# Altium schematic sheet PocketPilot.SchDoc
size A4; SheetNumber: 2; SheetTotal: 3
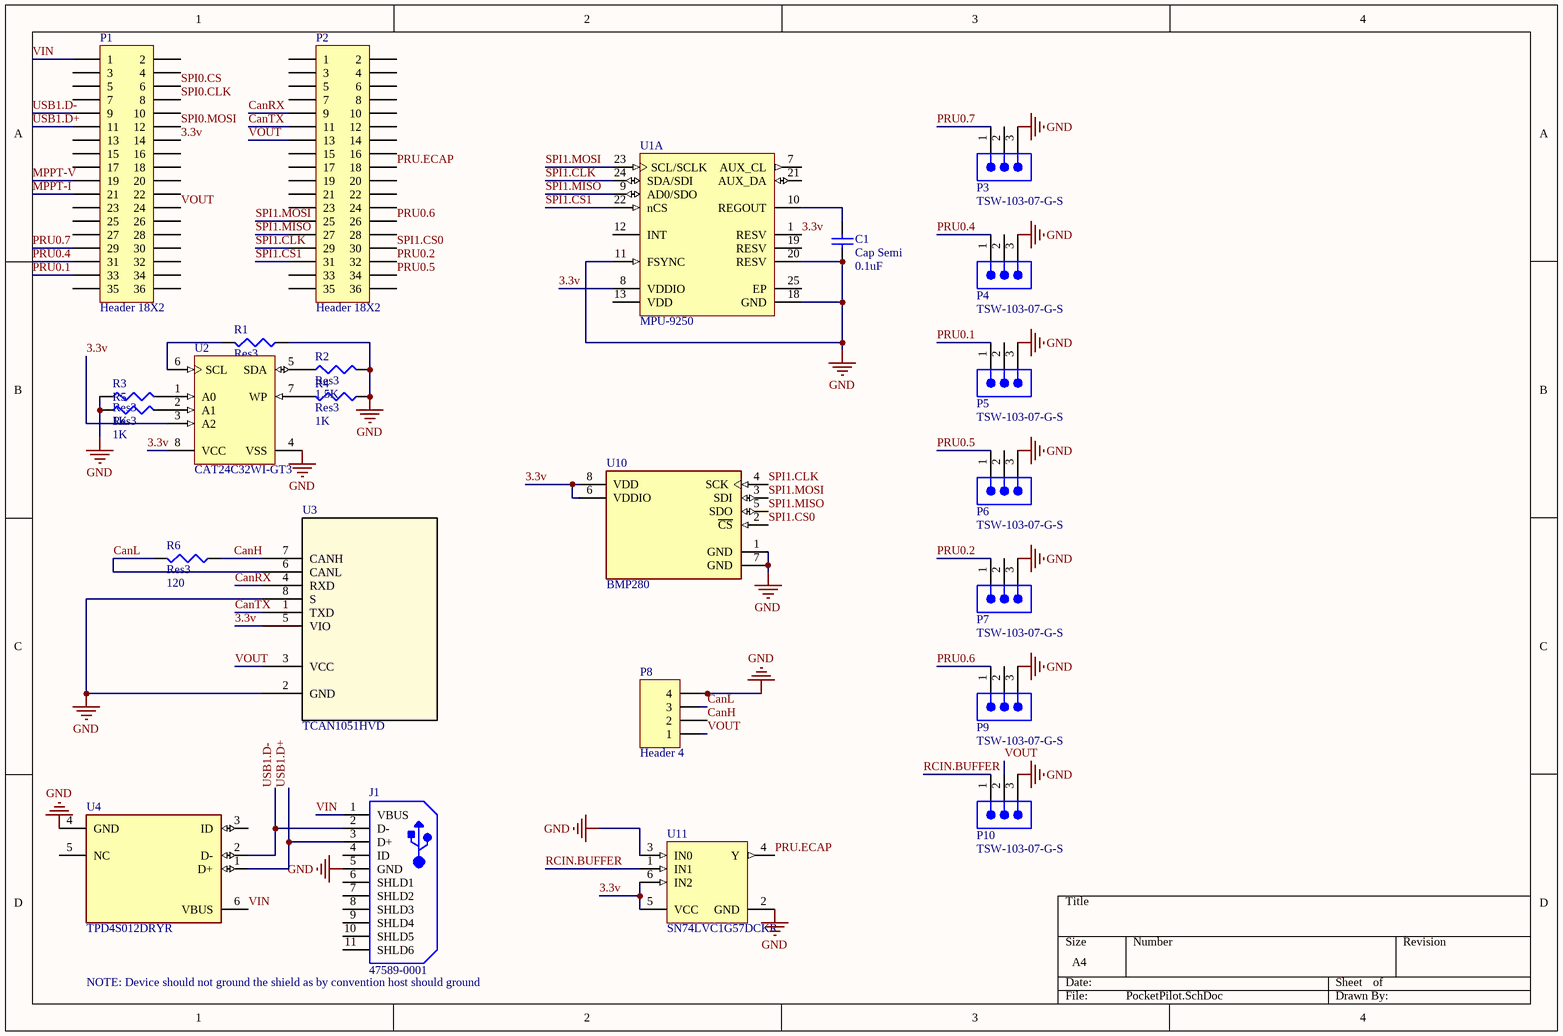
[diagram p0: PocketPilot.SchDoc]

## Parts
C1  Cap Semi  value 0.1uF  [C1206]
J1  47589-0001  [MOLX-47589-0001_V]
P1  Header 18X2  [HDR2X18]
P2  Header 18X2  [HDR2X18]
P3  TSW-103-07-G-S  [SMTC-TSW-103-07-X-S]
P4  TSW-103-07-G-S  [SMTC-TSW-103-07-X-S]
P5  TSW-103-07-G-S  [SMTC-TSW-103-07-X-S]
P6  TSW-103-07-G-S  [SMTC-TSW-103-07-X-S]
P7  TSW-103-07-G-S  [SMTC-TSW-103-07-X-S]
P8  Header 4  [HDR1X4]
P9  TSW-103-07-G-S  [SMTC-TSW-103-07-X-S]
P10  TSW-103-07-G-S  [SMTC-TSW-103-07-X-S]
R1  Res3  value 1.5K  [J1-0603]
R2  Res3  value 1.5K  [J1-0603]
R3  Res3  value 1K  [J1-0603]
R4  Res3  value 1K  [J1-0603]
R5  Res3  value 1K  [J1-0603]
R6  Res3  value 120  [J1-0603]
U1  MPU-9250  [INSE-QFN-24-1700X1540TP_M]  (part A of 2)
U2  CAT24C32WI-GT3  [ONSC-SOIC-8-751BD-01_M]
U3  TCAN1051HVD  [D8_TEX]
U4  TPD4S012DRYR  [FP-DRY0006A-MFG]
U10  BMP280  [FP-BMP280-MFG]
U11  SN74LVC1G57DCKR  [DCK0006A_N]

## Nets
GND: C1.1 J1.5(GND) P3.3 P4.3 P5.3 P6.3 P7.3 P8.4 P9.3 P10.3 R1.1 R2.2 R3.1 R4.1 R5.1 U1.11(FSYNC) U1.18(GND) U1.20(RESV) U2.4(VSS) U3.2(GND) U3.8(S) U4.4(GND) U10.1(GND) U10.7(GND) U11.2(GND) U11.3(IN0)
3.3v: P1.14 U1.1(RESV) U1.8(VDDIO) U2.3(A2) U2.8(VCC) U3.5(VIO) U10.6(VDDIO) U10.8(VDD) U11.5(VCC) U11.6(IN2)
CanH: P8.2 R6.1 U3.7(CANH)
CanL: P8.3 R6.2 U3.6(CANL)
CanRX: P2.9 U3.4(RXD)
CanTX: P2.11 U3.1(TXD)
MPPT-I: P1.21
MPPT-V: P1.19
PRU0.1: P1.33 P5.1
PRU0.2: P2.32 P7.1
PRU0.4: P1.31 P4.1
PRU0.5: P2.34 P6.1
PRU0.6: P2.26 P9.1
PRU0.7: P1.29 P3.1
PRU.ECAP: P2.18 U11.4(Y)
RCIN.BUFFER: P10.1 U11.1(IN1)
SPI0.CLK: P1.8
SPI0.CS: P1.6
SPI0.MOSI: P1.12
SPI1.CLK: P2.29 U1.24(SDA/SDI) U10.4(SCK)
SPI1.CS0: P2.30 U10.2(~{CS})
SPI1.CS1: P2.31 U1.22(nCS)
SPI1.MISO: P2.27 U1.9(AD0/SDO) U10.5(SDO)
SPI1.MOSI: P2.25 U1.23(SCL/SCLK) U10.3(SDI)
USB1.D+: J1.3(D+) P1.11 U4.1(D+)
USB1.D-: J1.2(D-) P1.9 U4.2(D-)
VIN: J1.1(VBUS) P1.1 U4.6(VBUS)
VOUT: P1.24 P2.13 P8.1 P10.2 U3.3(VCC)
NetC1_2: C1.2 U1.10(REGOUT)
NetR1_2: R1.2 U2.6(SCL)
NetR2_1: R2.1 U2.5(SDA)
NetR3_2: R3.2 U2.1(A0)
NetR4_2: R4.2 U2.7(WP)
NetR5_2: R5.2 U2.2(A1)

Not connected (* = marked no-connect by the designer): J1 4(ID) 6(SHLD1) 7(SHLD2) 8(SHLD3) 9(SHLD4) 10(SHLD5) 11(SHLD6); P1 2 3 4 5 7 10 13 15 16 17 18 20 22 23 25 26 27 28 30 32 34 35 36; P2 1 2 3 4 5 6 7 8 10 12 14 15 16 17 19 20 21 22 23 24 28 33 35 36; P3 2; P4 2; P5 2; P6 2; P7 2; P9 2; U1 7(AUX_CL) 12(INT) 13(VDD) 19(RESV) 21(AUX_DA) 25(EP); U4 3(ID) 5(NC)

## Notes on the sheet
- (near J1) NOTE: Device should not ground the shield as by convention host should ground

## Library data of the parts
C1 = Cap Semi: Capacitor (Semiconductor SIM Model); Published: 8-Jun-2000; LatestRevisionDate: 29-May-2009; LatestRevisionNote: IPC-7351 Footprint Added.; PackageReference: C1206; Publisher: Altium Limited; PackageDescription: Chip Capacitor
J1 = CMP-2000-05610-1: Right Angle Female Type AB Micro USB Connector, 30 V, 1.8 A, -30 to 85 degC, RoHS, Tape and Reel; Number of Ports: 1Port; Current Rating: 1.8A; Brand: Molex; Connector Type: MicroUSBTypeABreceptacle; Number of Contacts: 5Contact; Voltage Rating: 30VAC; Color: Black; Product: MicroUSBTypeABConnectors; Package URL: http://www.molex.com/pdm_docs/sd/475890001_sd.pdf; Contact Plating: Gold; Datasheet URL: http://www.molex.com/webdocs/datasheets/pdf/en-us/0475890001_IO_CONNECTORS.pdf; Operating Temperature Range: -20Cto+85C; Termination Style: SMD/SMT; Mounting Angle: Right; Package Reference: 47589-0001; Gender: Female; Package Description: Micro USB Connector, Pitch 0.65 mm, 5 Positions, Body 7.5 x 5.6 mm; Mounting Technology: SurfaceMount; Contact Material: CopperAlloy; Packaging: Reel; RoHS: True; Standard: USB; Manufacturer URL: http://www.molex.com/; Manufacturer: Molex; Datasheet Version: 12/2016; Product Category: USBConnectors; Series: 47589
P1 P2 = Header 18X2: Header, 18-Pin, Dual row; LatestRevisionDate: 17-Jul-2002; LatestRevisionNote: Re-released for DXP Platform.; Publisher: Altium Limited
P3-P7 P9 P10 = CMP-1024-00333-1: 0.025" SQ Post Header, Through-hole, Vertical, -55 to 125 degC, 2.54 mm Pitch, 3-Pin, Male, RoHS; Manufacturer: Samtec; Pitch: 2.54 mm; ComponentLink3URL: http://www.samtec.com/documents/webfiles/cpdf/TSW-XXX-XX-XXX-X-XX-XXX-MKT.pdf; Temperature Range: -55 to 125 degC; DatasheetVersion: F-214; ComponentLink1Description: Manufacturer URL; ComponentLink2URL: http://www.samtec.com/documents/webfiles/pdf/TSW_TH.PDF; RoHS: True; Orientation: Vertical; ComponentLink2Description: Datasheet; ComponentLink3Description: Package Specification; PackageDescription: .025[0.64] SQ. Post Terminal Strip Assembly; Mounting Technology: Through-hole; PackageVersion: DM, 8/1988; ComponentLink1URL: http://www.samtec.com; PackageReference: TSW-103-07-X-S; PartNumber: TSW-103-07-G-S
P8 = Header 4: Header, 4-Pin; LatestRevisionDate: 17-Jul-2002; LatestRevisionNote: Re-released for DXP Platform.; Publisher: Altium Limited
R1-R6 = Res3: Resistor; Published: 8-Jun-2000; LatestRevisionDate: 29-May-2009; LatestRevisionNote: IPC-7351 Footprint Added.; PackageReference: J1-0603; Publisher: Altium Limited; PackageDescription: Chip Resistor
U1 = CMP-2100-03657-1: 9-axis MotionTracking device, 2.4 to 3,6 V, -40 to 85 degC, 24-Pin QFN, RoHS, Tape and Reel; Manufacturer: InvenSense; Max Supply Voltage: 3.6V; Min Supply Voltage: 2.4V; Package Reference: QFN-24; Package Quantity: 1; Datasheet Version: Rev. 1.0, 01/2014; Case/Package: QFN; Package Description: 24-Pin Quad Flat No-lead Package, Body 3 x 3 mm, Pitch 0.4 mm; Datasheet URL: http://datasheet.octopart.com/MPU-9250-InvenSense-datasheet-21859386.pdf; RoHSCompliant: true; Max Operating Temperature: 85degC; Height: 1mm; Mount: SurfaceMount; Manufacturer URL: http://www.invensense.com/; Width: 3.1mm; Min Operating Temperature: -40degC; Length: 3.1mm
U2 = CMP-1679-00009-1: I2C CMOS Serial EEPROM, 32 Kb, 1.7 to 5.5 V, -40 to 85 degC, 8-Pin SOIC (751BD), RoHS, Tape and Reel; Case\Package: TO-226-3; hFE Min: 100; Elements: 1; Max Power Dissipation: 625 mW; Frequency: 300 MHz; Vce Max: 1 V; ComponentLink1URL: http://www.onsemi.com/; Mount: Through Hole; REACH SVHC: No SVHC; Packaging: Bulk; Height: 5.33 mm; PackageDescription: 8-Pin Small Outline Integrated Circuit, Body 4.9 x 3.9 mm, Pitch 1.27 mm; ComponentLink2Description: Datasheet; DatasheetVersion: Rev. 24, 06/2015; ComponentLink1Description: Manufacturer URL; PackageReference: SOIC-8-751BD-01; Length: 5.2 mm; ComponentLink2URL: http://www.onsemi.com/pub_link/Collateral/CAT24C32-D.PDF; Pins: 3; Min Operating Temperature: -55 degC; ComponentLink3URL: http://www.onsemi.com/pub_link/Collateral/751BD.PDF; Weight: 0.006314 oz; Max Operating Temperature: 150 degC; Package Quantity: 1000; ComponentLink3Description: Package Specification; Width: 4.19 mm; RoHSCompliant: true; Radiation Hardening: No
U3 = TCAN1051HVD: No Description Available; SourceLibrary: TI_2019-05-11; Built_By: EMA_Molly; Vendor: Texas Instruments; Copyright: Copyright (C) 2018 Accelerated Designs. All rights reserved; Manufacturer_Part_Number: TCAN1051HVD; RefDes: RefDes; Type: DEV
U4 = CMP-0326-00038-4: TVS DIODE 5.5V 6SON; Breakdown Voltage: 24V; Interface: USB; ESD Protection: Yes; Peak Pulse Power: 60W; Number of Circuits: 4; Polarity: Unidirectional; Capacitance: 15pF; Test Current: 1mA; Working Voltage: 19V; Min Breakdown Voltage: 6V; Peak Pulse Current: 3A; Operating Supply Voltage: 950mV; Max Operating Temperature: 85°C; Packaging: Tape and Reel; Termination: SMD/SMT; Number of Pins: 6; Radiation Hardening: No; Width: 1.05mm; REACH SVHC: No SVHC; Lead Free: Lead Free; Depth: 1mm; Package Quantity: 5000; Length: 1.45mm; Direction: Unidirectional; Min Operating Temperature: -40°C; Number of Channels: 4; Max Power Dissipation: 60W; Height: 0.55mm
U10 = CMP-2000-05076-3: SENSOR PRESSURE ABS; Operating Pressure: 15.95PSI; Pressure Type: Absolute; Output Type: SPI; Max Pressure: 290.08PSI; Port Style: No Port; Case/Package: SMD/SMT; Lead Free: Lead Free; Termination: SMD/SMT; Min Operating Temperature: -40°C; Number of Pins: 8; Max Operating Temperature: 85°C
U11 = CMP-0859-00501-3: CONFIGURABLE MULTIPLE-FUNCTION GATE, DCK0006A, LARGE T&R; Manufacturer: Texas Instruments; Logic: True; Voltage(Nom)(V): 1.8,2.5,3.3,5; VCC(Max)(V): 5.5; Sub-Family: Configurable Logic; tpd @ Nom Voltage(Max)(ns): 14.4,8.3,6.3,5.1; VCC(Min)(V): 1.65; Input Type: CMOS/TTL; Technology Family: LVC; 3-State Output: No; Rating: Catalog; Output Type: CMOS; ICC @ Nom Voltage(Max)(mA): 0.01; Output Drive (IOL/IOH)(Max)(mA): 32/-32; F @ Nom Voltage(Max)(Mhz): 150; Bits(#): 1; PackageReference: DCK0006A; DatasheetVersion: SCES414O; Operating Temperature Range(C): -40 to 125; Generic Part Number: SN74LVC1G57; Schmitt Trigger: No; Gate Type: Configurable